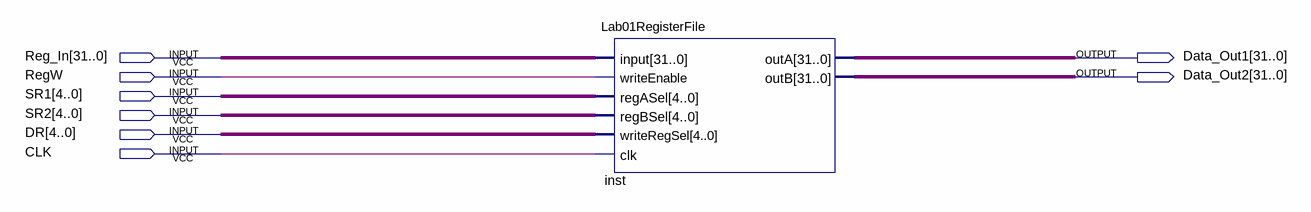
[diagram p0: schematic sheet]
// Quartus schematic RegisterFile.bdf as structural Verilog: 1 symbols, 8 pins
module RegisterFile (
  input  [31:0] Reg_In,
  input  RegW,
  input  [4:0] SR1,
  input  [4:0] SR2,
  input  [4:0] DR,
  input  CLK,
  output [31:0] Data_Out1,
  output [31:0] Data_Out2
);

  Lab01RegisterFile inst (
    .\input (Reg_In), .writeEnable(RegW), .regASel(SR1), .regBSel(SR2), .writeRegSel(DR), .clk(CLK),
    .outA(Data_Out1), .outB(Data_Out2));
endmodule
